# Altium schematic sheet Small_Relay.SchDoc: Low Current Relay
size A4; Organization: Altium Limited; Address1: L3, 12a Rodborough Rd; Address2: Frenchs Forest; Address3: NSW; Address4: Australia 2086
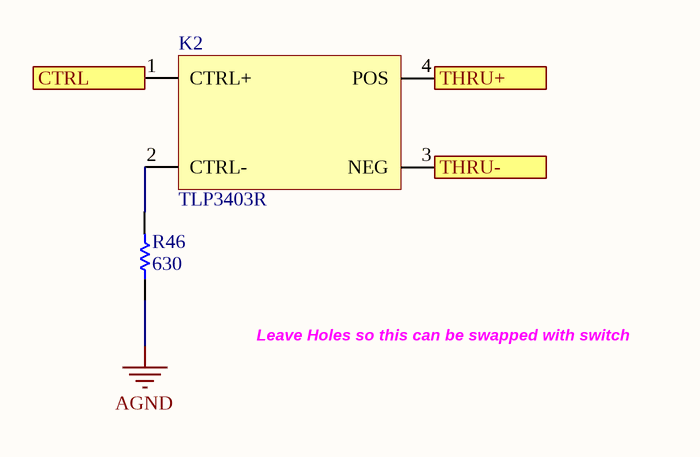
[diagram p0: Small_Relay.SchDoc]

## Parts
K2  TLP3403R  [VSONR4]
R46  630  [0402_Res]

## Ports
CTRL (in), THRU+ (in), THRU- (in)

## Nets
AGND: R46.1
CTRL: K2.1(CTRL+) ; port CTRL
THRU+: K2.4(POS) ; port THRU+
THRU-: K2.3(NEG) ; port THRU-
NetK2_2: K2.2(CTRL-) R46.2

## Notes on the sheet
- Leave Holes so this can be swapped with switch
- Title
- Date:
- RE:
- Arturo di Girolamo
- Size:
- A3
- A

## Library data of the parts
R46 = ERJ-PB6D7501V: 7.5K 1% 1/4W; Value: 1K; ASYPN: RK73B1ETTP621J; MFGPN: ERJ-PB6D7501V
K2 = TLP3403R: ASYPN: TLP3403R